# EasyEDA schematic SCH_Namu_Board_v1_2023-11-06.json
TITLE: Namu_Development_Board; REV: 1.0; Date: 2023-10-10; Sheet: 1/1; Company: Namu
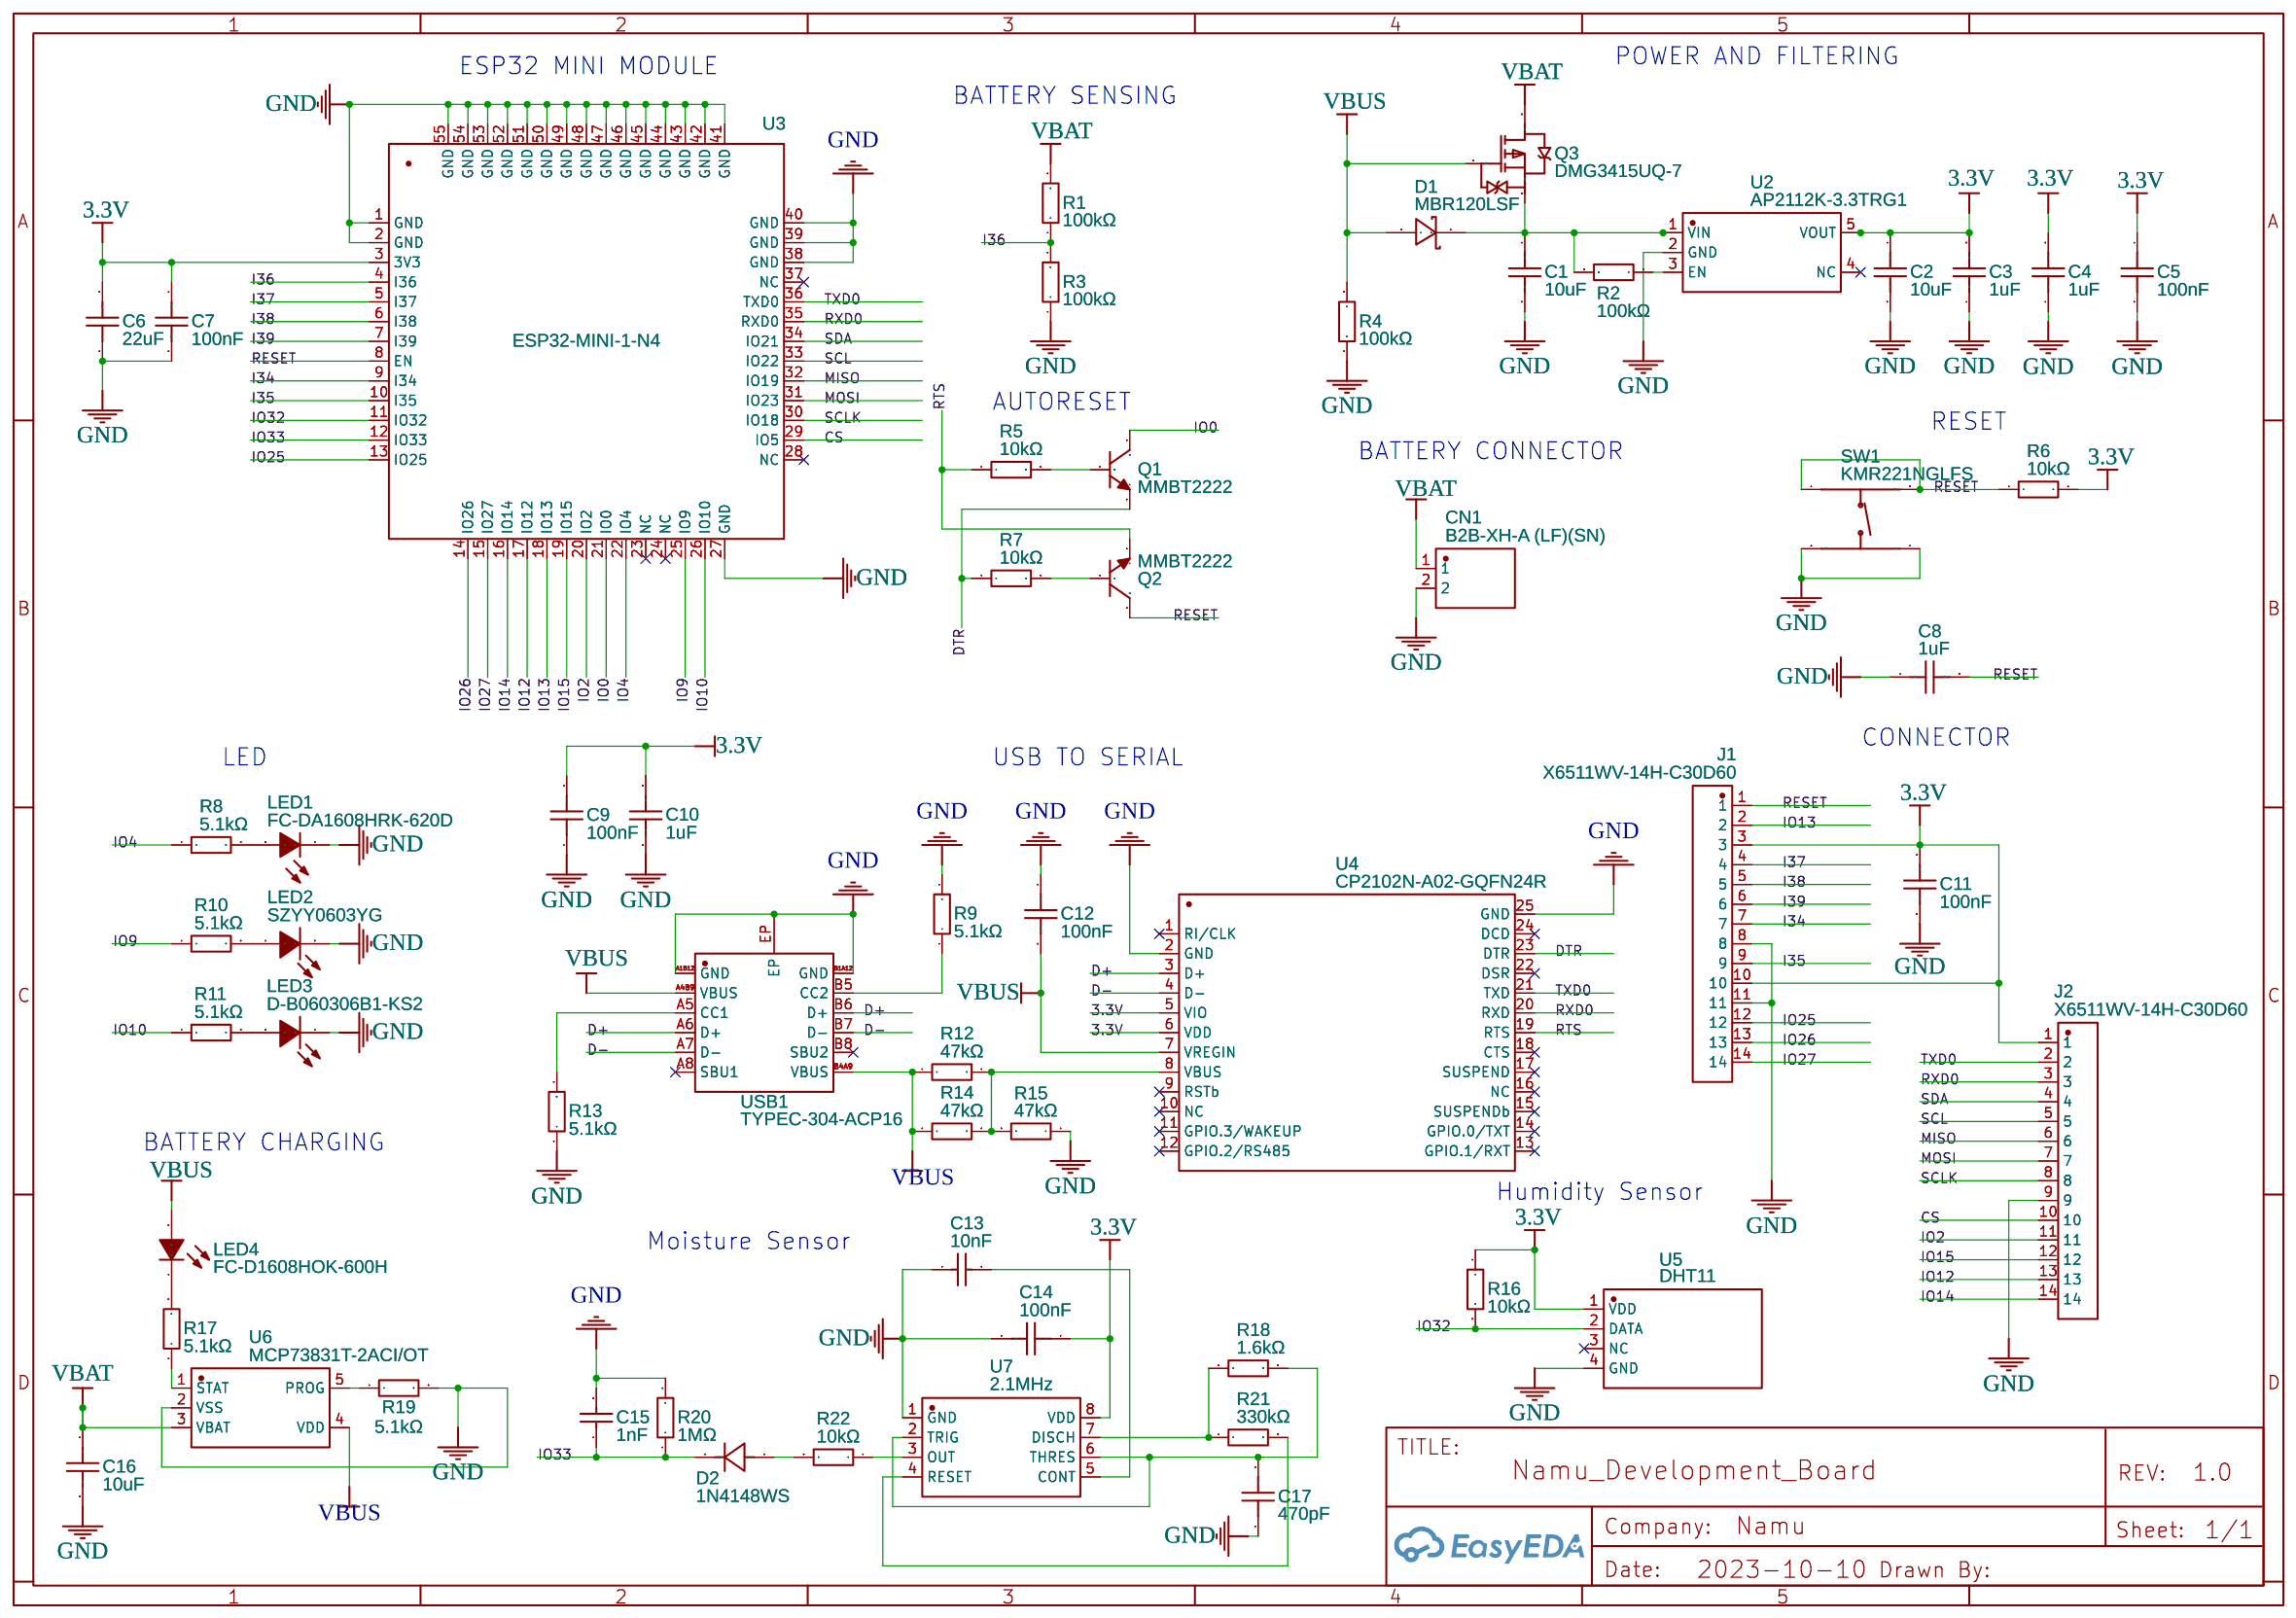
[diagram p0: schematic sheet]

## Parts
C1  10uF  [C1206]
C2  10uF  [C1206]
C3  1uF  [C0603]
C4  1uF  [C0603]
C5  100nF  [C0402]
C6  22uF  [C1206]
C7  100nF  [C0402]
C8  1uF  [C0603]
C9  100nF  [C0402]
C10  1uF  [C0603]
C11  100nF  [C0402]
C12  100nF  [C0402]
C13  10nF  [C0402]
C14  100nF  [C0402]
C15  1nF  [C0402]
C16  10uF  [C1206]
C17  470pF  [C0402]
CN1  B2B-XH-A (LF)(SN)  [CONN-TH_B2B-XH-A-LF-SN]
D1  MBR120LSF  [SOD-123_L2.8-W1.8-LS3.7-RD]
D2  1N4148WS  [SOD-323_L1.8-W1.3-LS2.5-RD]
J1  X6511WV-14H-C30D60  [HDR-TH_14P-P2.54-V-M]
J2  X6511WV-14H-C30D60  [HDR-TH_14P-P2.54-V-M]
LED1  FC-DA1608HRK-620D  [LED0603-RD_RED]
LED2  SZYY0603YG  [LED0603-R-RD_GREEN]
LED3  D-B060306B1-KS2  [LED0603-RD]
LED4  FC-D1608HOK-600H  [LED0603-RD]
Q1  MMBT2222  [SOT-23-3_L2.9-W1.4-P1.91-LS2.6-BR]
Q2  MMBT2222  [SOT-23-3_L2.9-W1.4-P1.91-LS2.6-BR]
Q3  DMG3415UQ-7  [SOT-23-3_L2.9-W1.6-P1.90-LS2.8-BR]
R1  100kΩ  [R0603]
R2  100kΩ  [R0603]
R3  100kΩ  [R0603]
R4  100kΩ  [R0603]
R5  10kΩ  [R0603]
R6  10kΩ  [R0603]
R7  10kΩ  [R0603]
R8  5.1kΩ  [R0402]
R9  5.1kΩ  [R0402]
R10  5.1kΩ  [R0402]
R11  5.1kΩ  [R0402]
R12  47kΩ  [R0402]
R13  5.1kΩ  [R0402]
R14  47kΩ  [R0402]
R15  47kΩ  [R0402]
R16  10kΩ  [R0603]
R17  5.1kΩ  [R0402]
R18  1.6kΩ  [R0402]
R19  5.1kΩ  [R0402]
R20  1MΩ  [R0402]
R21  330kΩ  [R0402]
R22  10kΩ  [R0603]
SW1  KMR221NGLFS  [KEY-SMD_4P-L4.2-W2.8-P1.60-LS4.6]
U2  AP2112K-3.3TRG1  [SOT-25-5_L2.9-W1.6-P0.95-LS2.8-BL]
U3  ESP32-MINI-1-N4  [WIFI-SMD_ESP32-MINI-1]
U4  CP2102N-A02-GQFN24R  [QFN-24_L4.0-W4.0-P0.50-TL-EP2.6]
U5  DHT11  [SENSOR-TH_DHT11]
U6  MCP73831T-2ACI/OT  [SOT-23-5_L3.0-W1.7-P0.95-LS2.8-BL]
U7  2.1MHz  [SOIC-8_L4.9-W3.9-P1.27-LS6.0-BL]
USB1  TYPEC-304-ACP16  [USB-C-SMD_TYPE-C-16P-1]

## Library data of the parts
C1 C2 C16 = CS3216X7R106K250NRI: Contributor: LCSC; Supplier: LCSC; Supplier Part: C513767; Manufacturer: SAMWHA(三和); JLCPCB Part Class: Extended Part; link: https://lcsc.com/eda_search?q=C513767&%26type=1&ref=editor
C3 C4 C8 C10 = CS1608X7R105K250NRB: Contributor: LCSC; Supplier: LCSC; Supplier Part: C513775; Manufacturer: SAMWHA(三和); JLCPCB Part Class: Extended Part; link: https://lcsc.com/eda_search?q=C513775&%26type=1&ref=editor
C5 C7 C9 C11 C12 C14 = C1005X5R1C104KT000F: Contributor: LCSC; Supplier: LCSC; Supplier Part: C338011; Manufacturer: TDK; JLCPCB Part Class: Extended Part; link: https://lcsc.com/eda_search?q=C338011&%26type=1&ref=editor
C6 = CS3216X5R226K160NRI: Contributor: LCSC; Supplier: LCSC; Supplier Part: C513771; Manufacturer: SAMWHA(三和); JLCPCB Part Class: Extended Part; link: https://lcsc.com/eda_search?q=C513771&%26type=1&ref=editor
C13 = CC0402KRX7R9BB103: Supplier: LCSC; Manufacturer: YAGEO(国巨); Supplier Part: C60133; JLCPCB Part Class: Extended Part; link: https://lcsc.com/eda_search?q=C60133&%26type=1&ref=editor
C15 = CC0402KRX7R9BB102: Contributor: LCSC; Supplier: LCSC; Manufacturer: YAGEO(国巨); Supplier Part: C106205; JLCPCB Part Class: Extended Part; link: https://lcsc.com/eda_search?q=C106205&%26type=1&ref=editor
C17 = CC0402KRX7R9BB471: Supplier: LCSC; Manufacturer: YAGEO(国巨); Supplier Part: C106207; JLCPCB Part Class: Extended Part; link: https://lcsc.com/eda_search?q=C106207&%26type=1&ref=editor
CN1 = B2B-XH-A (LF)(SN): Contributor: LCSC; Supplier: LCSC; Supplier Part: C158012; Manufacturer: JST; Manufacturer Part: B2B-XH-A(LF)(SN); JLCPCB Part Class: Extended Part; link: https://lcsc.com/eda_search?q=C158012&%26type=1&ref=editor
D1 = MBR120LSF: Contributor: LCSC; Supplier: LCSC; Manufacturer: SHIKUES(时科); Supplier Part: C130880; JLCPCB Part Class: Extended Part; link: https://lcsc.com/eda_search?q=C130880&%26type=1&ref=editor
D2 = 1N4148WS_C727111: Contributor: LCSC; Supplier: LCSC; Supplier Part: C727111; Manufacturer: TWGMC(台湾迪嘉); JLCPCB Part Class: Extended Part; link: https://lcsc.com/eda_search?q=C727111&%26type=1&ref=editor
J1 J2 = X6511WV-14H-C30D60: Contributor: LCSC; Supplier: LCSC; Supplier Part: C725946; Manufacturer: XKB Connectivity(中国星坤); JLCPCB Part Class: Extended Part; link: https://lcsc.com/eda_search?q=C725946&%26type=1&ref=editor
LED1 = FC-DA1608HRK-620D: Supplier: LCSC; Manufacturer: 国星光电; Manufacturer Part: NCD0603R1; Supplier Part: C84263; JLCPCB Part Class: Extended Part; link: https://lcsc.com/eda_search?q=C84263&%26type=1&ref=editor
LED2 = SZYY0603YG: Contributor: LCSC; Supplier: LCSC; Supplier Part: C434423; Manufacturer: yongyu(永裕光电); JLCPCB Part Class: Extended Part; link: https://lcsc.com/eda_search?q=C434423&%26type=1&ref=editor
LED3 = D-B060306B1-KS2: Contributor: LCSC; Supplier: LCSC; Supplier Part: C118339; Manufacturer: ARKLED(方舟); Manufacturer Part: D-060306B1; JLCPCB Part Class: Extended Part; link: https://lcsc.com/eda_search?q=C118339&%26type=1&ref=editor
LED4 = FC-D1608HOK-600H: Supplier: LCSC; Manufacturer: 国星光电; Manufacturer Part: NCD0603O1; Supplier Part: C84269; JLCPCB Part Class: Extended Part; link: https://lcsc.com/eda_search?q=C84269&%26type=1&ref=editor
Q1 Q2 = MMBT2222: Contributor: LCSC; Supplier: LCSC; Supplier Part: C2891810; Manufacturer: YONGYUTAI(永裕泰); JLCPCB Part Class: Extended Part; link: https://lcsc.com/eda_search?q=C2891810&%26type=1&ref=editor
Q3 = DMG3415UQ-7: Contributor: LCSC; Supplier: LCSC; Supplier Part: C459537; Manufacturer: DIODES(美台); JLCPCB Part Class: Extended Part; link: https://lcsc.com/eda_search?q=C459537&%26type=1&ref=editor
R1-R4 = 0603WAF1003T5E: Supplier: LCSC; Manufacturer: UNI-ROYAL(厚声); Supplier Part: C25803; JLCPCB Part Class: Basic Part; link: https://lcsc.com/eda_search?q=C25803&%26type=1&ref=editor
R5-R7 R16 R22 = RC0603FR-0710KL: Supplier: LCSC; Manufacturer: YAGEO(国巨); Supplier Part: C98220; JLCPCB Part Class: Extended Part; link: https://lcsc.com/eda_search?q=C98220&%26type=1&ref=editor
R8-R11 R13 R17 R19 = RMC04025.1K5%N: Contributor: LCSC; Supplier: LCSC; Supplier Part: C325524; Manufacturer: Tyohm(幸亚电阻); JLCPCB Part Class: Extended Part; link: https://lcsc.com/eda_search?q=C325524&%26type=1&ref=editor
R12 R14 R15 = 0402WGF4702TCE: Supplier: LCSC; Manufacturer: UNI-ROYAL(厚声); Supplier Part: C25792; JLCPCB Part Class: Basic Part; link: https://lcsc.com/eda_search?q=C25792&%26type=1&ref=editor
R18 = 0402WGF1601TCE: Supplier: LCSC; Manufacturer: UNI-ROYAL(厚声); Supplier Part: C4908; JLCPCB Part Class: Extended Part; link: https://lcsc.com/eda_search?q=C4908&%26type=1&ref=editor
R20 = 0402WGF1004TCE: Supplier: LCSC; Manufacturer: UNI-ROYAL(厚声); Supplier Part: C26083; JLCPCB Part Class: Basic Part; link: https://lcsc.com/eda_search?q=C26083&%26type=1&ref=editor
R21 = 0402WGF3303TCE: Supplier: LCSC; Manufacturer: UNI-ROYAL(厚声); Supplier Part: C25778; JLCPCB Part Class: Basic Part; link: https://lcsc.com/eda_search?q=C25778&%26type=1&ref=editor
SW1 = KMR221NGLFS: Contributor: LCSC; Supplier: LCSC; Supplier Part: C269272; Manufacturer: C&K; JLCPCB Part Class: Extended Part; link: https://lcsc.com/eda_search?q=C269272&%26type=1&ref=editor
U2 = AP2112K-3.3TRG1: Contributor: LCSC; Supplier: LCSC; Manufacturer: DIODES(美台); Supplier Part: C51118; JLCPCB Part Class: Extended Part; link: https://lcsc.com/eda_search?q=C51118&%26type=1&ref=editor
U3 = ESP32-MINI-1-N4: Contributor: LCSC; Supplier: LCSC; Supplier Part: C2980305; Manufacturer: ESPRESSIF(乐鑫); JLCPCB Part Class: Extended Part; link: https://lcsc.com/eda_search?q=C2980305&%26type=1&ref=editor
U4 = CP2102N-A02-GQFN24R: Contributor: LCSC; Supplier: LCSC; Supplier Part: C969151; Manufacturer: SILICON LABS(芯科); JLCPCB Part Class: Extended Part; link: https://lcsc.com/eda_search?q=C969151&%26type=1&ref=editor
U5 = DHT11: Contributor: LCSC; Supplier: LCSC; Supplier Part: C117051; Manufacturer: 广州奥松; JLCPCB Part Class: Extended Part; link: https://lcsc.com/eda_search?q=C117051&%26type=1&ref=editor
U6 = MCP73831T-2ACI/OT: Contributor: LCSC; Supplier: LCSC; Supplier Part: C424093; Manufacturer: MICROCHIP(美国微芯); JLCPCB Part Class: Extended Part; link: https://lcsc.com/eda_search?q=C424093&%26type=1&ref=editor
U7 = TLC555IDR: Supplier: LCSC; Manufacturer: TI(德州仪器); Supplier Part: C6987; JLCPCB Part Class: Extended Part; link: https://lcsc.com/eda_search?q=C6987&%26type=1&ref=editor
USB1 = TYPEC-304-ACP16: Contributor: LCSC; Supplier: LCSC; Supplier Part: C2982555; Manufacturer: XUNPU(讯普); JLCPCB Part Class: Extended Part; link: https://lcsc.com/eda_search?q=C2982555&%26type=1&ref=editor

## Nets
3.3V: C2.1 C3.2 C4.2 C5.1 C6.2 C7.1 C9.2 C10.2 C11.1 C14.1 J1.3 J1.10 J2.1 R6.2 R16.1 U2.5(VOUT) U3.3(3V3) U4.5(VIO) U4.6(VDD) U5.1(VDD) U7.8(VDD)
GND: C1.2 C2.2 C3.1 C4.1 C5.2 C6.1 C7.2 C8.1 C9.1 C10.1 C11.2 C12.1 C13.1 C14.2 C15.2 C16.2 C17.1 CN1.2 J1.8 J1.11 J2.9 LED1.1(K) LED2.2(-) LED3.1 R3.1 R4.1 R9.2 R13.1 R15.1 R19.2 R20.2 SW1.3 SW1.4 U2.2(GND) U3.1(GND) U3.2(GND) U3.27(GND) U3.38(GND) U3.39(GND) U3.40(GND) U3.41(GND) U3.42(GND) U3.43(GND) U3.44(GND) U3.45(GND) U3.46(GND) U3.47(GND) U3.48(GND) U3.49(GND) U3.50(GND) U3.51(GND) U3.52(GND) U3.53(GND) U3.54(GND) U3.55(GND) U4.2(GND) U4.25(GND) U5.4(GND) U6.2(VSS) U7.1(GND) USB1.A1B12(GND) USB1.B1A12(GND) USB1.EP
VBAT: C16.1 CN1.1 Q3.3(D) R1.2 U6.3(VBAT)
VBUS: C12.2 D1.2(A) LED4.2(A) Q3.1(G) R4.2 R12.1 R14.1 U4.7(VREGIN) U6.4(VDD) USB1.A4B9(VBUS) USB1.B4A9(VBUS)
CS: J2.10 U3.29(IO5)
D+: U4.3(D+) USB1.A6(D+) USB1.B6(D+)
D-: U4.4(D-) USB1.A7(D-) USB1.B7(D-)
DTR: Q1.2(E) R7.1 U4.23(DTR)
I34: J1.7 U3.9(I34)
I35: J1.9 U3.10(I35)
I36: R1.1 R3.2 U3.4(I36)
I37: J1.4 U3.5(I37)
I38: J1.5 U3.6(I38)
I39: J1.6 U3.7(I39)
IO0: Q1.3(C) U3.21(IO0)
IO2: J2.11 U3.20(IO2)
IO4: R8.1 U3.22(IO4)
IO9: R10.1 U3.25(IO9)
IO10: R11.1 U3.26(IO10)
IO12: J2.13 U3.17(IO12)
IO13: J1.2 U3.18(IO13)
IO14: J2.14 U3.16(IO14)
IO15: J2.12 U3.19(IO15)
IO25: J1.12 U3.13(IO25)
IO26: J1.13 U3.14(IO26)
IO27: J1.14 U3.15(IO27)
IO32: R16.2 U3.11(IO32) U5.2(DATA)
IO33: C15.1 D2.1(C) R20.1 U3.12(IO33)
MISO: J2.6 U3.32(IO19)
MOSI: J2.7 U3.31(IO23)
RESET: C8.2 J1.1 Q2.3(C) R6.1 SW1.1 SW1.2 U3.8(EN)
RTS: Q2.2(E) R5.1 U4.19(RTS)
RXD0: J2.3 U3.35(RXD0) U4.20(RXD)
SCL: J2.5 U3.33(IO22)
SCLK: J2.8 U3.30(IO18)
SDA: J2.4 U3.34(IO21)
TXD0: J2.2 U3.36(TXD0) U4.21(TXD)
Net-(C1-1): C1.1 D1.1(C) Q3.2(S) R2.2 U2.1(VIN)
Net-(C13-2): C13.2 U7.5(CONT)
Net-(C17-2): C17.2 R18.2 U7.2(TRIG) U7.6(THRES)
Net-(D2-2): D2.2(A) R22.2
Net-(LED1-2): LED1.2(A) R8.2
Net-(LED2-1): LED2.1(+) R10.2
Net-(LED3-2): LED3.2 R11.2
Net-(LED4-1): LED4.1(K) R17.2
Net-(Q1-1): Q1.1(B) R5.2
Net-(Q2-1): Q2.1(B) R7.2
Net-(R2-1): R2.1 U2.3(EN)
Net-(R9-1): R9.1 USB1.B5(CC2)
Net-(R12-2): R12.2 R14.2 R15.2 U4.8(VBUS)
Net-(R13-2): R13.2 USB1.A5(CC1)
Net-(R17-1): R17.1 U6.1(STAT)
Net-(R18-1): R18.1 R21.1 U7.7(DISCH)
Net-(R19-1): R19.1 U6.5(PROG)
Net-(R21-2): R21.2 U7.4(RESET)
Net-(R22-1): R22.1 U7.3(OUT)

Not connected (* = marked no-connect by the designer): U2 4(NC)*; U3 23(NC)* 24(NC)* 28(NC)* 37(NC)*; U4 1(RI/CLK)* 9(RSTb)* 10(NC)* 11(GPIO.3/WAKEUP)* 12(GPIO.2/RS485)* 13(GPIO.1/RXT)* 14(GPIO.0/TXT)* 15(SUSPENDb)* 16(NC)* 17(SUSPEND)* 18(CTS)* 22(DSR)* 24(DCD)*; U5 3(NC)*; USB1 A8(SBU1)* B8(SBU2)*

## Notes on the sheet
- POWER AND FILTERING
- ESP32 MINI MODULE
- BATTERY SENSING
- AUTORESET
- RESET
- BATTERY CONNECTOR
- LED
- USB TO SERIAL
- CONNECTOR
- BATTERY CHARGING
- Humidity Sensor
- Moisture Sensor
